# EAGLE schematic compact_rtu (EAGLE 9.6.2)
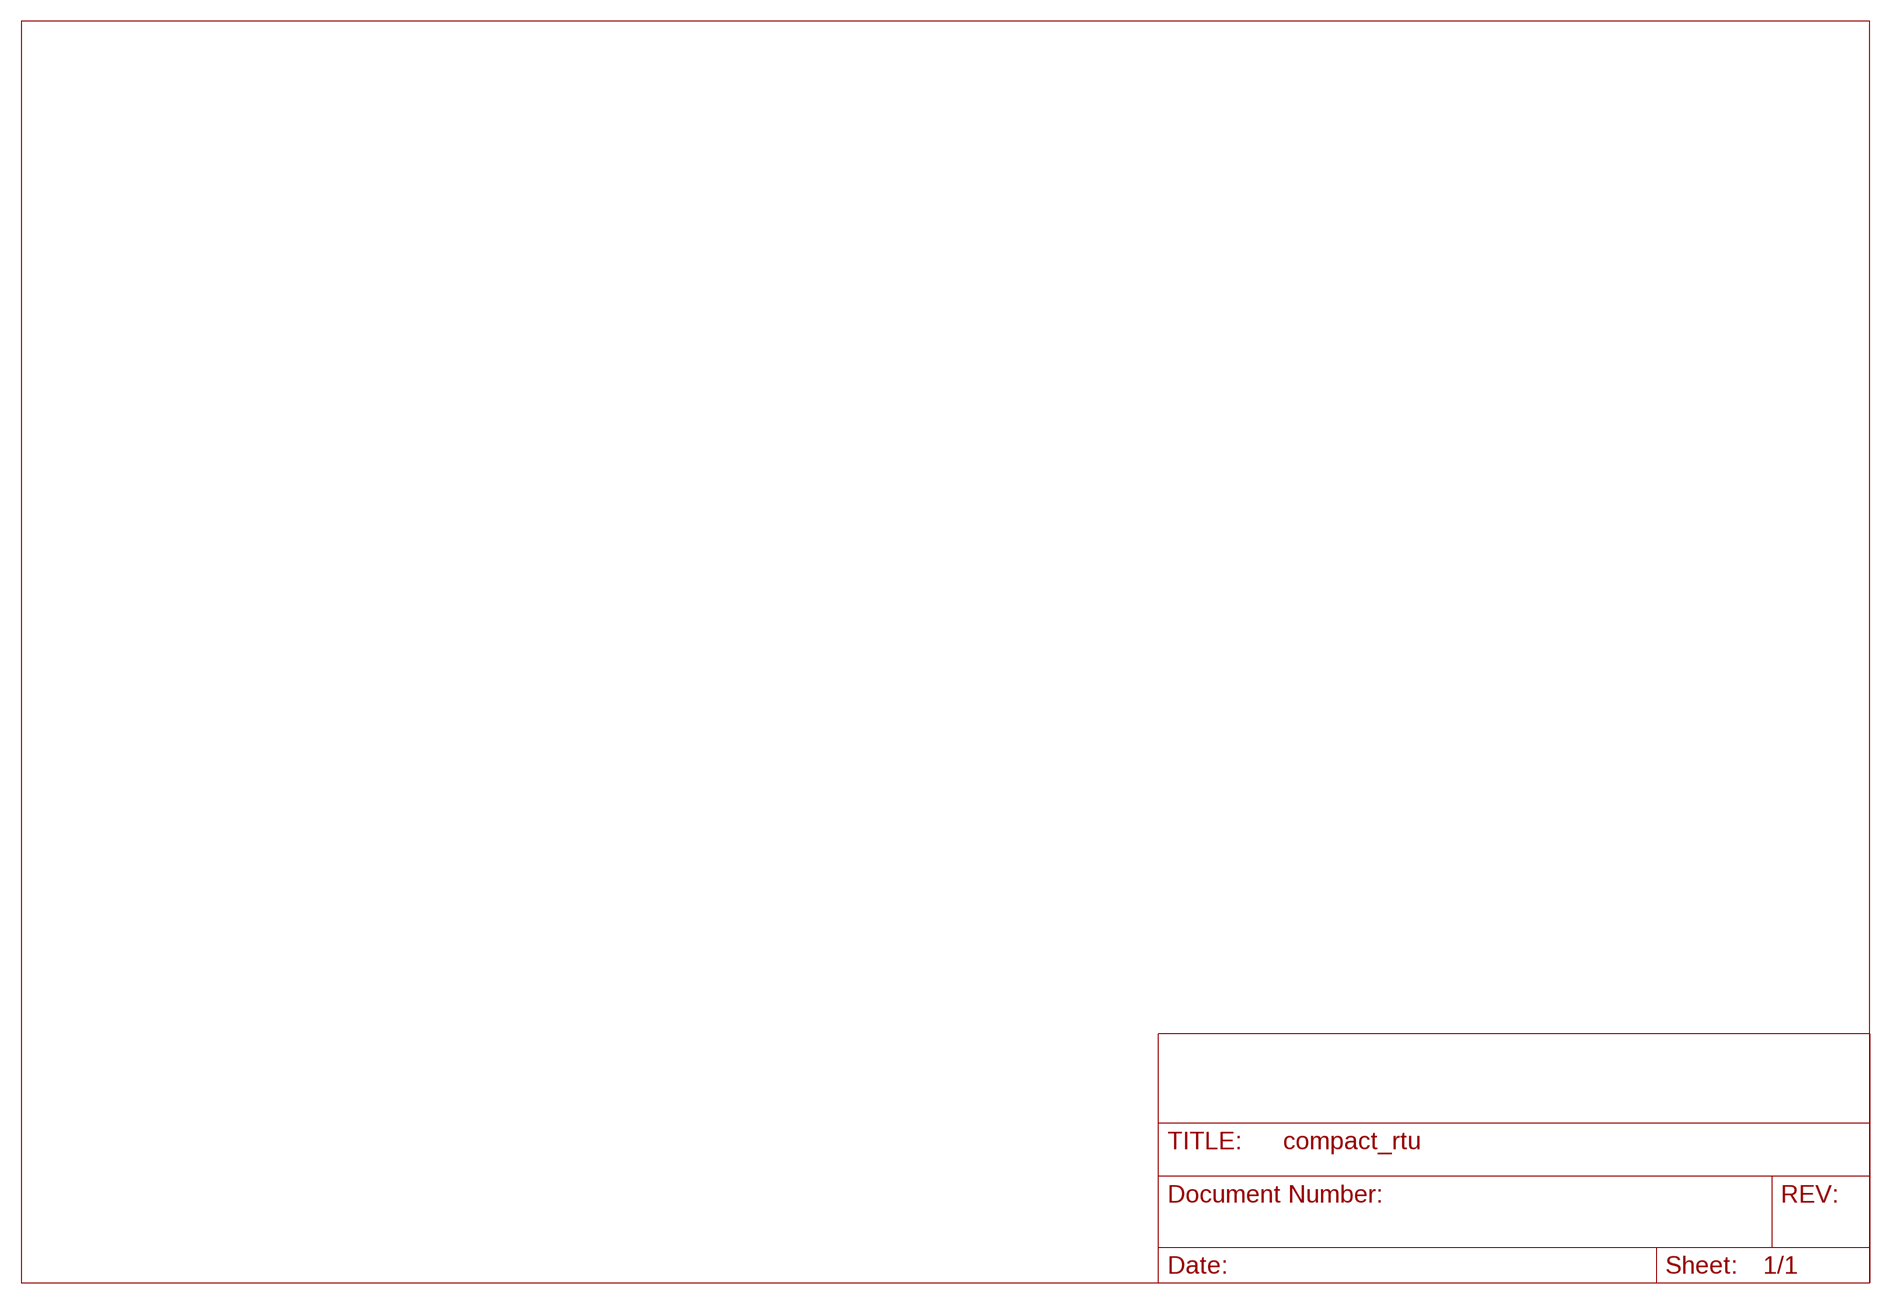
[diagram p0: schematic, sheet 1]

## Parts
U1  QFP50P1600X1600X120-100N  [QFP50P1600X1600X120-100N]  (not placed on a sheet)
U2  QFP50P1600X1600X120-100N  [QFP50P1600X1600X120-100N]  (not placed on a sheet)
U3  QFP50P1600X1600X120-100N  [QFP50P1600X1600X120-100N]  (not placed on a sheet)
U4  QFP50P1600X1600X120-100N  [QFP50P1600X1600X120-100N]  (not placed on a sheet)

## Library data of the parts
U1-U4 = QFP50P1600X1600X120-100N:QFP50P1600X1600X120-100N: AVR 32 UC3 C Microcontroller IC 32-Bit 66MHz 512KB (512K x 8) FLASH 100-TQFP (14x14); A1_MIN: 0.1; A_MAX: 1.2; B_MAX: 0.27; B_MIN: 0.17; B_NOM: 0.22; D1_MAX: 14.0; D1_MIN: 14.0; D1_NOM: 14.0; D2_NOM: 0.0; D_MAX: 16.0; D_MIN: 16.0; D_NOM: 16.0; E1_MAX: 14.0; E1_MIN: 14.0; E1_NOM: 14.0; E2_NOM: 0.0; ENOM: 0.5; E_MAX: 16.0; E_MIN: 16.0; E_NOM: 16.0; L_MAX: 0.75; L_MIN: 0.45; L_NOM: 0.6; MANUFACTURER: Microchip; PIN_COUNT_D: 25.0; PIN_COUNT_E: 25.0; SNAPEDA_PACKAGE_ID: 52219; STANDARD: IPC 7351B